# Altium schematic sheet 01_low cost 6308.SchDoc
size A3; SheetNumber: 2; SheetTotal: 16
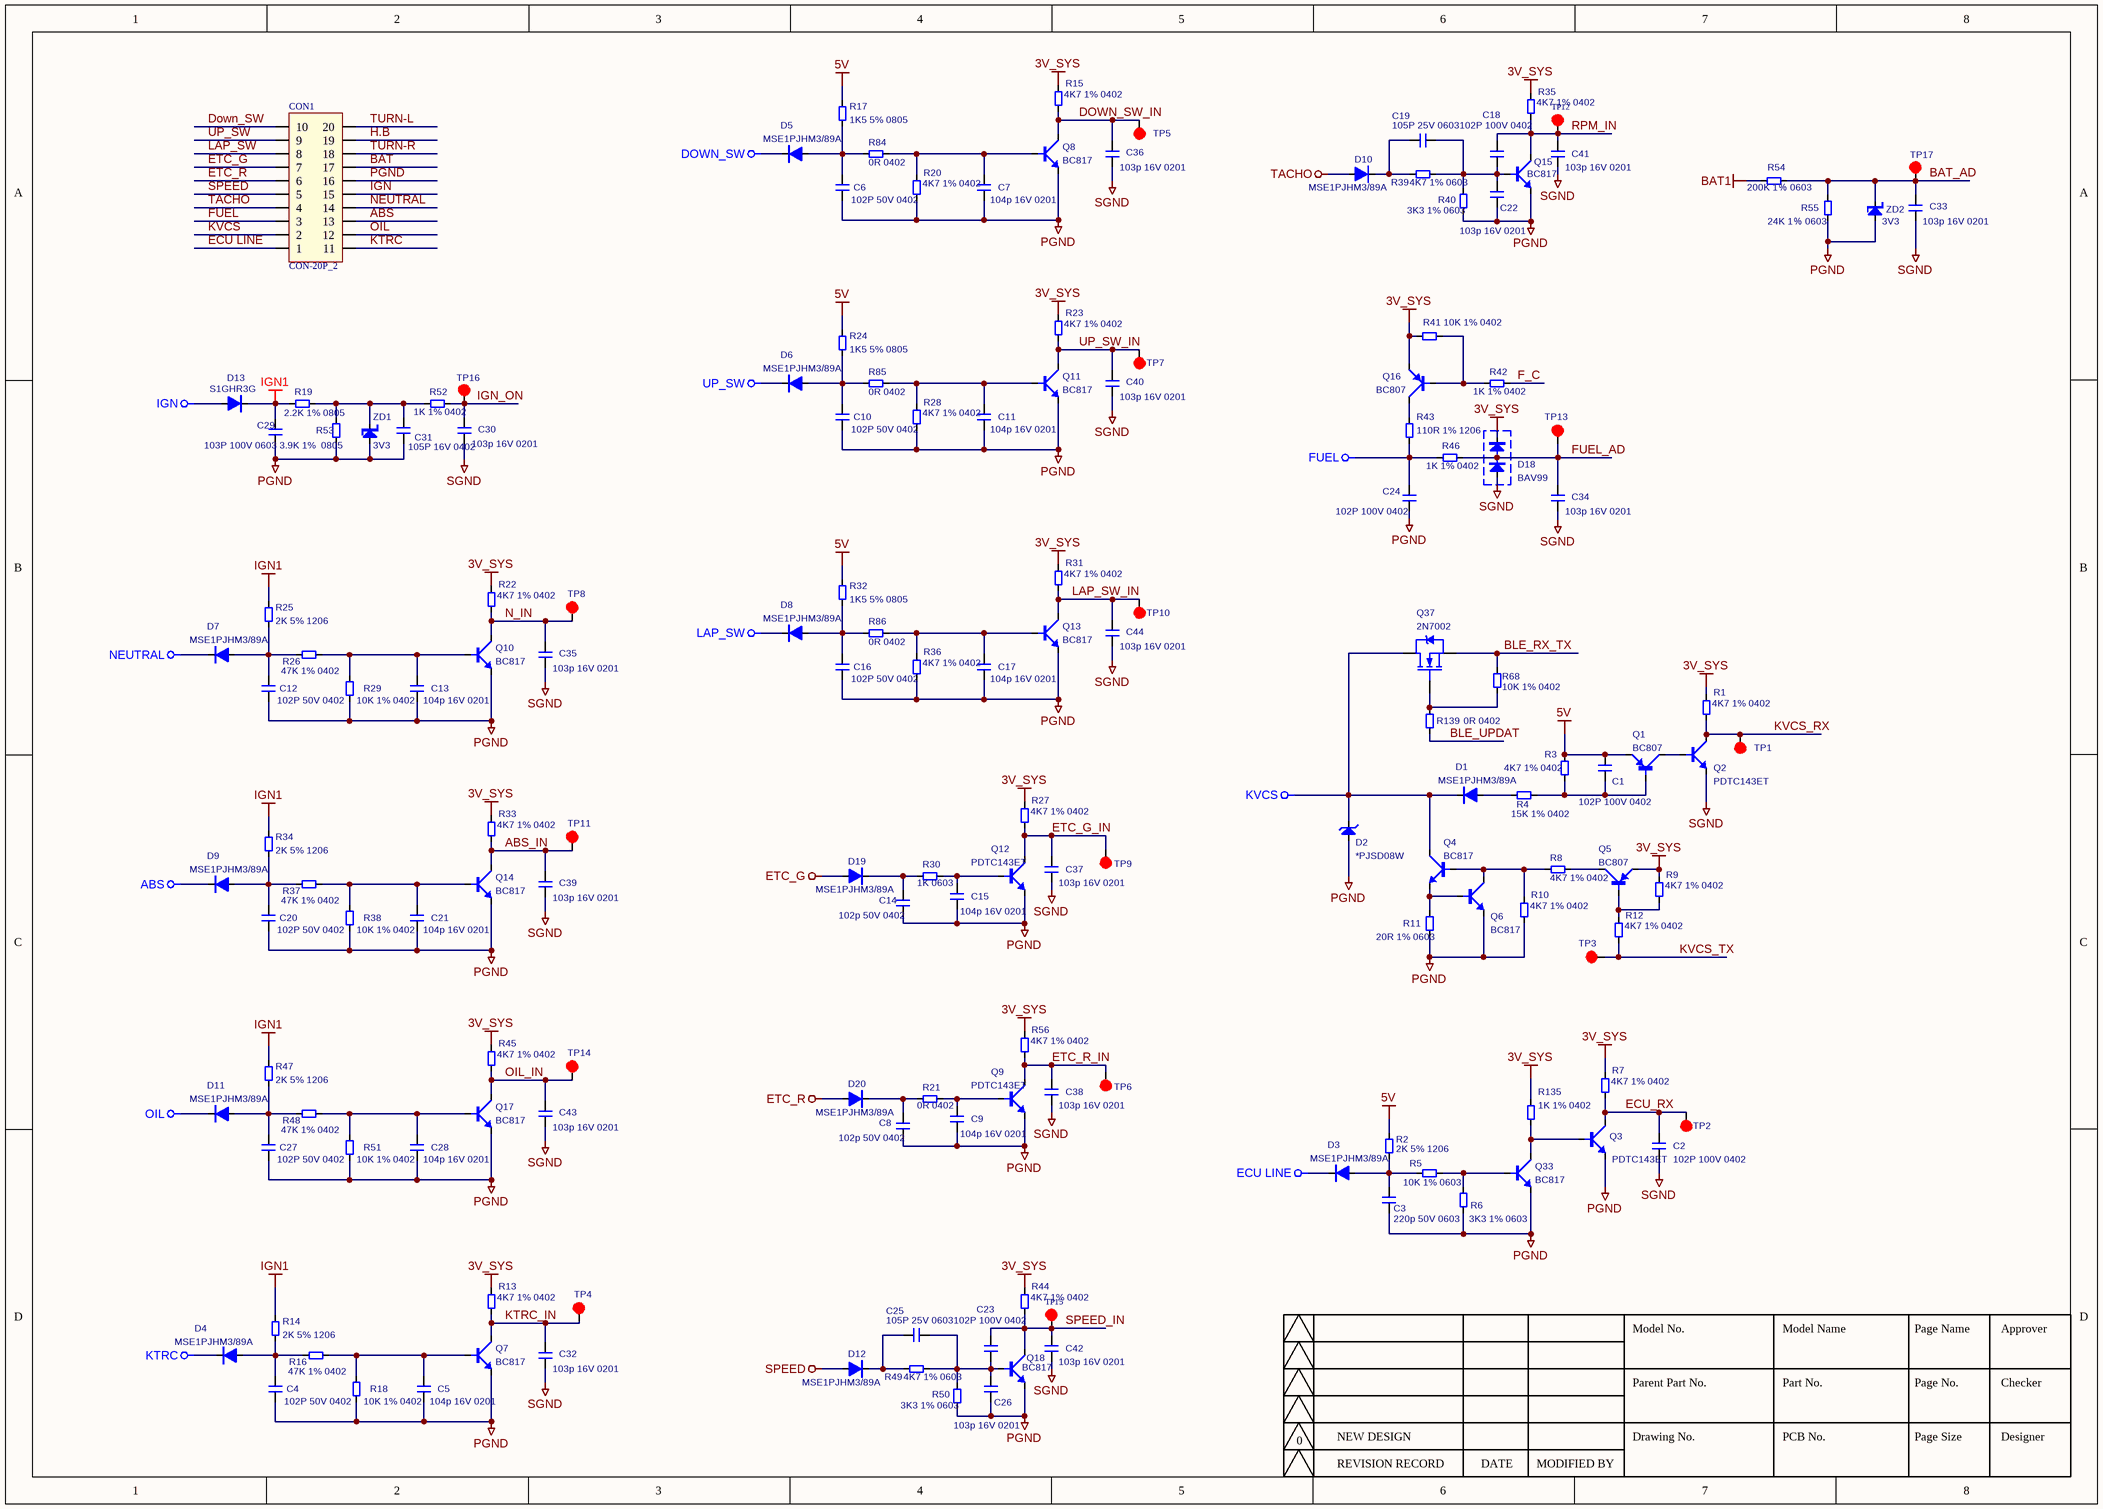
[diagram p0: 01_low cost 6308.SchDoc]

## Parts
C1  102P 100V 0402  [C0402]
C2  102P 100V 0402  [C0402]
C3  220p 50V 0603  [C0603]
C4  102P 50V 0402  [C0402]
C5  104p 16V 0201  [C0201]
C6  102P 50V 0402  [C0402]
C7  104p 16V 0201  [C0201]
C8  102p 50V 0402  [C0402]
C9  104p 16V 0201  [C0201]
C10  102P 50V 0402  [C0402]
C11  104p 16V 0201  [C0201]
C12  102P 50V 0402  [C0402]
C13  104p 16V 0201  [C0201]
C14  102p 50V 0402  [C0402]
C15  104p 16V 0201  [C0201]
C16  102P 50V 0402  [C0402]
C17  104p 16V 0201  [C0201]
C18  102P 100V 0402  [C0402]
C19  105P 25V 0603  [C0603]
C20  102P 50V 0402  [C0402]
C21  104p 16V 0201  [C0201]
C22  103p 16V 0201  [C0201]
C23  102P 100V 0402  [C0402]
C24  102P 100V 0402  [C0402]
C25  105P 25V 0603  [C0603]
C26  103p 16V 0201  [C0201]
C27  102P 50V 0402  [C0402]
C28  104p 16V 0201  [C0201]
C29  103P 100V 0603  [C0603]
C30  103p 16V 0201  [C0201]
C31  105P 16V 0402  [C0402]
C32  103p 16V 0201  [C0201]
C33  103p 16V 0201  [C0201]
C34  103p 16V 0201  [C0201]
C35  103p 16V 0201  [C0201]
C36  103p 16V 0201  [C0201]
C37  103p 16V 0201  [C0201]
C38  103p 16V 0201  [C0201]
C39  103p 16V 0201  [C0201]
C40  103p 16V 0201  [C0201]
C41  103p 16V 0201  [C0201]
C42  103p 16V 0201  [C0201]
C43  103p 16V 0201  [C0201]
C44  103p 16V 0201  [C0201]
CON1  CON-20P_2  [CON-MX34020UF]
D1  MSE1PJHM3/89A  [D-DO-219AD]
D2  *PJSD08W  [ZD-SOD323]
D3  MSE1PJHM3/89A  [D-DO-219AD]
D4  MSE1PJHM3/89A  [D-DO-219AD]
D5  MSE1PJHM3/89A  [D-DO-219AD]
D6  MSE1PJHM3/89A  [D-DO-219AD]
D7  MSE1PJHM3/89A  [D-DO-219AD]
D8  MSE1PJHM3/89A  [D-DO-219AD]
D9  MSE1PJHM3/89A  [D-DO-219AD]
D10  MSE1PJHM3/89A  [D-DO-219AD]
D11  MSE1PJHM3/89A  [D-DO-219AD]
D12  MSE1PJHM3/89A  [D-DO-219AD]
D13  S1GHR3G  [D-SMA]
D18  BAV99  [SOT23-RF]
D19  MSE1PJHM3/89A  [D-DO-219AD]
D20  MSE1PJHM3/89A  [D-DO-219AD]
Q1  BC807  [SOT323]
Q2  PDTC143ET  [SOT23-RF]
Q3  PDTC143ET  [SOT23-RF]
Q4  BC817  [SOT323]
Q5  BC807  [SOT323]
Q6  BC817  [SOT323]
Q7  BC817  [SOT323]
Q8  BC817  [SOT323]
Q9  PDTC143ET  [SOT23-RF]
Q10  BC817  [SOT323]
Q11  BC817  [SOT323]
Q12  PDTC143ET  [SOT23-RF]
Q13  BC817  [SOT323]
Q14  BC817  [SOT323]
Q15  BC817  [SOT323]
Q16  BC807  [SOT23-RF]
Q17  BC817  [SOT323]
Q18  BC817  [SOT323]
Q33  BC817  [SOT323]
Q37  2N7002  [SOT23-RF]
R1  4K7 1% 0402  [0402]
R2  2K 5% 1206  [1206]
R3  4K7 1% 0402  [0402]
R4  15K 1% 0402  [0402]
R5  10K 1% 0603  [0603]
R6  3K3 1% 0603  [0603]
R7  4K7 1% 0402  [0402]
R8  4K7 1% 0402  [0402]
R9  4K7 1% 0402  [0402]
R10  4K7 1% 0402  [0402]
R11  20R 1% 0603  [0603]
R12  4K7 1% 0402  [0402]
R13  4K7 1% 0402  [0402]
R14  2K 5% 1206  [1206]
R15  4K7 1% 0402  [0402]
R16  47K 1% 0402  [0402]
R17  1K5 5% 0805  [0805]
R18  10K 1% 0402  [0402]
R19  2.2K 1% 0805  [0805]
R20  4K7 1% 0402  [0402]
R21  0R 0402  [0402]
R22  4K7 1% 0402  [0402]
R23  4K7 1% 0402  [0402]
R24  1K5 5% 0805  [0805]
R25  2K 5% 1206  [1206]
R26  47K 1% 0402  [0402]
R27  4K7 1% 0402  [0402]
R28  4K7 1% 0402  [0402]
R29  10K 1% 0402  [0402]
R30  1K 0603  [0603]
R31  4K7 1% 0402  [0402]
R32  1K5 5% 0805  [0805]
R33  4K7 1% 0402  [0402]
R34  2K 5% 1206  [1206]
R35  4K7 1% 0402  [0402]
R36  4K7 1% 0402  [0402]
R37  47K 1% 0402  [0402]
R38  10K 1% 0402  [0402]
R39  4K7 1% 0603  [0603]
R40  3K3 1% 0603  [0603]
R41  10K 1% 0402  [0402]
R42  1K 1% 0402  [0402]
R43  110R 1% 1206  [1206]
R44  4K7 1% 0402  [0402]
R45  4K7 1% 0402  [0402]
R46  1K 1% 0402  [0402]
R47  2K 5% 1206  [1206]
R48  47K 1% 0402  [0402]
R49  4K7 1% 0603  [0603]
R50  3K3 1% 0603  [0603]
R51  10K 1% 0402  [0402]
R52  1K 1% 0402  [0402]
R53  3.9K 1%  0805  [0805]
R54  200K 1％ 0603  [0603]
R55  24K 1％ 0603  [0603]
R56  4K7 1% 0402  [0402]
R68  10K 1% 0402  [0402]
R84  0R 0402  [0402]
R85  0R 0402  [0402]
R86  0R 0402  [0402]
R135  1K 1% 0402  [0402]
R139  0R 0402  [0402]
TP1  TEST  [TEST]  (value not drawn)  (no BOM)
TP2  TEST  [TEST]  (value not drawn)  (no BOM)
TP3  TEST  [TEST]  (value not drawn)  (no BOM)
TP4  TEST  [TEST]  (value not drawn)  (no BOM)
TP5  TEST  [TEST]  (value not drawn)  (no BOM)
TP6  TEST  [TEST]  (value not drawn)
TP7  TEST  [TEST]  (value not drawn)  (no BOM)
TP8  TEST  [TEST]  (value not drawn)  (no BOM)
TP9  TEST  [TEST]  (value not drawn)
TP10  TEST  [TEST]  (value not drawn)  (no BOM)
TP11  TEST  [TEST]  (value not drawn)  (no BOM)
TP12  TEST  [TEST]  (value not drawn)
TP13  TEST  [TEST]  (value not drawn)  (no BOM)
TP14  TEST  [TEST]  (value not drawn)  (no BOM)
TP15  TEST  [TEST]  (value not drawn)
TP16  TEST  [TEST]  (value not drawn)
TP17  TEST  [TEST]  (value not drawn)  (no BOM)
ZD1  3V3  [SOT23-RF]
ZD2  3V3  [SOT23-RF]

## Nets
3V_SYS: D18.3(K) Q5.3(E) Q16.3(E) R1.1 R7.1 R9.1 R13.1 R15.1 R22.1 R23.1 R27.1 R31.1 R33.1 R35.1 R41.1 R44.1 R45.1 R56.1 R135.2
5V: C1.1 Q1.3(E) R2.1 R3.1 R17.1 R24.1 R32.1
ABS: CON1.13 D9.2(K)
BAT1: R54.1
Down_SW: CON1.10 D5.2(K)
ECU LINE: CON1.1 D3.2(K)
ETC_G: CON1.7 D19.1(A)
ETC_R: CON1.6 D20.1(A)
FUEL: C24.1 CON1.3 R43.2 R46.2
IGN: CON1.15 D13.1(A)
IGN1: C29.1 D13.2(K) R14.1 R19.1 R25.1 R34.1 R47.1
KTRC: CON1.11 D4.2(K)
KVCS: CON1.2 D1.2(K) D2.2 Q4.2(C) Q37.2(D)
LAP_SW: CON1.8 D8.2(K)
NEUTRAL: CON1.14 D7.2(K)
OIL: CON1.12 D11.2(K)
PGND: C3.1 C4.1 C5.2 C6.1 C7.2 C8.1 C9.2 C10.1 C11.2 C12.1 C13.2 C14.1 C15.2 C16.1 C17.2 C20.1 C21.2 C22.2 C24.2 C26.2 C27.1 C28.2 C29.2 C31.2 CON1.16 D2.1 Q3.3(E) Q6.3(E) Q7.3(E) Q8.3(E) Q9.3(E) Q10.3(E) Q11.3(E) Q12.3(E) Q13.3(E) Q14.3(E) Q15.3(E) Q17.3(E) Q18.3(E) Q33.3(E) R6.1 R10.2 R11.1 R18.2 R20.2 R28.2 R29.2 R36.2 R38.2 R40.1 R50.1 R51.2 R53.2 R55.2 ZD1.1(A) ZD2.1(A)
SGND: C2.2 C30.2 C32.2 C33.2 C34.2 C35.2 C36.2 C37.2 C38.2 C39.2 C40.2 C41.2 C42.2 C43.2 C44.2 D18.1(A) Q2.3(E)
SPEED: CON1.5 D12.1(A)
TACHO: CON1.4 D10.1(A)
UP_SW: CON1.9 D6.2(K)
ABS_IN: C39.1 Q14.2(C) R33.2 TP11.TP
BAT: CON1.17
BAT_AD: C33.1 R54.2 R55.1 TP17.TP ZD2.2(K)
BLE_RX_TX: Q37.3(S) R68.2
BLE_UPDAT: R139.1
DOWN_SW_IN: C36.1 Q8.2(C) R15.2 TP5.TP
ECU_RX: C2.1 Q3.2(C) R7.2 TP2.TP
ETC_G_IN: C37.1 Q12.2(C) R27.2 TP9.TP
ETC_R_IN: C38.1 Q9.2(C) R56.2 TP6.TP
F_C: R42.1
FUEL_AD: C34.1 D18.2(KA) R46.1 TP13.TP
H.B: CON1.19
IGN_ON: C30.1 R52.1 TP16.TP
KTRC_IN: C32.1 Q7.2(C) R13.2 TP4.TP
KVCS_RX: Q2.2(C) R1.2 TP1.TP
KVCS_TX: R12.2 TP3.TP
LAP_SW_IN: C44.1 Q13.2(C) R31.2 TP10.TP
N_IN: C35.1 Q10.2(C) R22.2 TP8.TP
OIL_IN: C43.1 Q17.2(C) R45.2 TP14.TP
RPM_IN: C18.1 C41.1 Q15.2(C) R35.2 TP12.TP
SPEED_IN: C23.1 C42.1 Q18.2(C) R44.2 TP15.TP
TURN-L: CON1.20
TURN-R: CON1.18
UP_SW_IN: C40.1 Q11.2(C) R23.2 TP7.TP
NetC1_2: C1.2 Q1.1(B) R3.2 R4.2
NetC3_2: C3.2 D3.1(A) R2.2 R5.2
NetC4_2: C4.2 D4.1(A) R14.2 R16.2
NetC5_1: C5.1 Q7.1(B) R16.1 R18.1
NetC6_2: C6.2 D5.1(A) R17.2 R84.1
NetC7_1: C7.1 Q8.1(B) R20.1 R84.2
NetC8_2: C8.2 D20.2(K) R21.2
NetC9_1: C9.1 Q9.1(B) R21.1
NetC10_2: C10.2 D6.1(A) R24.2 R85.1
NetC11_1: C11.1 Q11.1(B) R28.1 R85.2
NetC12_2: C12.2 D7.1(A) R25.2 R26.2
NetC13_1: C13.1 Q10.1(B) R26.1 R29.1
NetC14_2: C14.2 D19.2(K) R30.2
NetC15_1: C15.1 Q12.1(B) R30.1
NetC16_2: C16.2 D8.1(A) R32.2 R86.1
NetC17_1: C17.1 Q13.1(B) R36.1 R86.2
NetC18_2: C18.2 C19.1 C22.1 Q15.1(B) R39.1 R40.2
NetC19_2: C19.2 D10.2(K) R39.2
NetC20_2: C20.2 D9.1(A) R34.2 R37.2
NetC21_1: C21.1 Q14.1(B) R37.1 R38.1
NetC23_2: C23.2 C25.1 C26.1 Q18.1(B) R49.1 R50.2
NetC25_2: C25.2 D12.2(K) R49.2
NetC27_2: C27.2 D11.1(A) R47.2 R48.2
NetC28_1: C28.1 Q17.1(B) R48.1 R51.1
NetC31_1: C31.1 R19.2 R52.2 R53.1 ZD1.2(K)
NetD1_1: D1.1(A) R4.1
NetQ1_2: Q1.2(C) Q2.1(B)
NetQ3_1: Q3.1(B) Q33.2(C) R135.1
NetQ4_1: Q4.1(B) Q6.2(C) R8.1 R10.1
NetQ4_3: Q4.3(E) Q6.1(B) R11.2
NetQ5_1: Q5.1(B) R9.2 R12.1
NetQ5_2: Q5.2(C) R8.2
NetQ16_1: Q16.1(B) R41.2 R42.2
NetQ16_2: Q16.2(C) R43.1
NetQ33_1: Q33.1(B) R5.1 R6.2
NetQ37_1: Q37.1(G) R68.1 R139.2

## Notes on the sheet
- Model No.
- Parent Part No.
- Part No.
- Model Name
- Page Name
- Page No.
- Approver
- Checker
- 0
- NEW DESIGN
- Drawing No.
- PCB No.
- Page Size
- Designer
- REVISION RECORD
- DATE
- MODIFIED BY

## Library data of the parts
C1 C2 C18 C23 C24 = C: Capacitor; z02-包裝or系列名稱: 0603，0805，1206，DIP; z01-耐壓or瓦特數: 16V，25V，50V，100V; z03-誤差: B，C，D，F，G，J，K，M，Z; z05-廠牌: MURATA，TDK; z04-參數: NPO，COG，X7R，Y5V; A-TOP: V31-01102201; 01-範例: 容值 耐壓 包裝 誤差 參數; z99-略1~101P: 50V 0603 J NP0(C0G) 廠牌; z99-略102P~104P↑: 50V 0603 K X7R  廠牌; z00-值or編碼: *P
C3 = C: Capacitor; z02-包裝or系列名稱: 0603，0805，1206，DIP; z01-耐壓or瓦特數: 16V，25V，50V，100V; z03-誤差: B，C，D，F，G，J，K，M，Z; z05-廠牌: MURATA，TDK; z04-參數: NPO，COG，X7R，Y5V; A-TOP: V31-22132; 01-範例: 容值 耐壓 包裝 誤差 參數; z99-略1~101P: 50V 0603 J NP0(C0G) 廠牌; z99-略102P~104P↑: 50V 0603 K X7R  廠牌; z00-值or編碼: *P
C4 C6 C8 C10 C12 C14 C16 C20 C27 = C: Capacitor; z02-包裝or系列名稱: 0603，0805，1206，DIP; z01-耐壓or瓦特數: 16V，25V，50V，100V; z03-誤差: B，C，D，F，G，J，K，M，Z; z05-廠牌: MURATA，TDK; z04-參數: NPO，COG，X7R，Y5V; A-TOP: V31-A1102200; 01-範例: 容值 耐壓 包裝 誤差 參數; z99-略1~101P: 50V 0603 J NP0(C0G) 廠牌; z99-略102P~104P↑: 50V 0603 K X7R  廠牌; z00-值or編碼: *P
C5 C7 C9 C11 C13 C15 C17 C21 C28 = C: Capacitor; z02-包裝or系列名稱: 0603，0805，1206，DIP; z01-耐壓or瓦特數: 16V，25V，50V，100V; z03-誤差: B，C，D，F，G，J，K，M，Z; z05-廠牌: MURATA，TDK; z04-參數: NPO，COG，X7R，Y5V; A-TOP: V31-A1104100; 01-範例: 容值 耐壓 包裝 誤差 參數; z99-略1~101P: 50V 0603 J NP0(C0G) 廠牌; z99-略102P~104P↑: 50V 0603 K X7R  廠牌; z00-值or編碼: *P
C19 C25 = C: Capacitor; z02-包裝or系列名稱: 0603，0805，1206，DIP; z01-耐壓or瓦特數: 16V，25V，50V，100V; z03-誤差: B，C，D，F，G，J，K，M，Z; z05-廠牌: MURATA，TDK; z04-參數: NPO，COG，X7R，Y5V; A-TOP: V31-10522; 01-範例: 容值 耐壓 包裝 誤差 參數; z99-略1~101P: 50V 0603 J NP0(C0G) 廠牌; z99-略102P~104P↑: 50V 0603 K X7R  廠牌; z00-值or編碼: *P
C22 C26 C30 C32-C44 = C: Capacitor; z02-包裝or系列名稱: 0603，0805，1206，DIP; z01-耐壓or瓦特數: 16V，25V，50V，100V; z03-誤差: B，C，D，F，G，J，K，M，Z; z05-廠牌: MURATA，TDK; z04-參數: NPO，COG，X7R，Y5V; A-TOP: V31-A1103100; 01-範例: 容值 耐壓 包裝 誤差 參數; z99-略1~101P: 50V 0603 J NP0(C0G) 廠牌; z99-略102P~104P↑: 50V 0603 K X7R  廠牌; z00-值or編碼: *P
C29 = C: Capacitor; z02-包裝or系列名稱: 0603，0805，1206，DIP; z01-耐壓or瓦特數: 16V，25V，50V，100V; z03-誤差: B，C，D，F，G，J，K，M，Z; z05-廠牌: MURATA，TDK; z04-參數: NPO，COG，X7R，Y5V; A-TOP: V31-01103300; 01-範例: 容值 耐壓 包裝 誤差 參數; z99-略1~101P: 50V 0603 J NP0(C0G) 廠牌; z99-略102P~104P↑: 50V 0603 K X7R  廠牌; z00-值or編碼: *P
C31 = C: Capacitor; z02-包裝or系列名稱: 0603，0805，1206，DIP; z01-耐壓or瓦特數: 16V，25V，50V，100V; z03-誤差: B，C，D，F，G，J，K，M，Z; z05-廠牌: MURATA，TDK; z04-參數: NPO，COG，X7R，Y5V; A-TOP: V31-01105200; 01-範例: 容值 耐壓 包裝 誤差 參數; z99-略1~101P: 50V 0603 J NP0(C0G) 廠牌; z99-略102P~104P↑: 50V 0603 K X7R  廠牌; z00-值or編碼: *P
CON1 = CON-20P_2: z10-LCD: 若為LCD，則A-TOP填入該料號。; A-TOP: 20P MX34; 01-範例: PIN數 系列 角度; z00-值or編碼: PIN數; z02-包裝or系列名稱: MX34，04040，04049; z08-腳長or角度: 90°=V，180°=略，上接=RU，下接-RL; z09-客戶專用: LOCAL件=L，日本原廠件不標
D1 D3-D12 D19 D20 = D-SMD: SK54-AU/BAS16/RR264/1N4148/FM4004/SS14/SSL14/V15PL50/DO-219AD; z2-包裝: 2F，SOT23，SMA，SMB，SMC，LL34，SOD323，PMDU，SOD123，SOD123FL，SMPC; z0-編號: BAS16，BAV99，RR264，1N4148W，FM4004，V15PL50; 01-範例: 編碼 包裝(SOT23略); A-TOP值參考: VS-1EQH02HM3，SK54-AU，MSE1PJHM3/89A; A-TOP: MSE1PJHM3/89A
D2 = TVS-SMD: A-TOP: PJSD08W SOD323
D13 = D-SMD: BAS16/RR264/1N4148/FM4004/SS14/SSL14/V15PL50; z2-包裝: SOT23，SMA，SMB，SMC，LL34，SOD323，PMDU，SOD123，SOD123FL，SMPC; z0-編號: BAS16，BAV99，RR264，1N4148，FM4004，SS14，SSL14，V15PL50; A-TOP: S1GHR; 01-範例: 編碼 包裝(SOT23略)
D18 = D-AKAK_1: z02-包裝or系列名稱: SOT23略; 01-範例: 編碼 包裝; z00-值or編碼: BAV99; A-TOP: BAV99
Q1 Q5 = Q-PNP(BCE): BC807，2SA1812，PBSS9110T; 包裝: SOT23，SOT89; A-TOP: new; 01-範例: 編碼 包裝(SOT23略); 編號: BC807，2SA1812，PBSS9110T
Q2 = Q-NPN(BCE): BC817/PDTC143ET/2SD2211/2SD1918; z0-編號: BC817，PDTC143ET，2SD2211，2SD1918; z1-包裝: SOT23，SOT89，DPAK; 01-範例: 編號 包裝(SOT23略略; A-TOP: PDTC143ET
Q3 Q9 Q12 = Q-NPN(BCE): BC817，PDTC143ET，2SD2211，2SD1918; 01-範例: 編號 包裝(SOT23略); z1-包裝: SOT23，SOT89，DPAK; A-TOP: PDTC143ET; z0-編號: BC817，PDTC143ET，2SD2211，2SD1918
Q4 Q7 Q8 Q10 Q11 Q13 Q14 Q17 Q33 = Q-NPN(BCE): BC817，PDTC143ET，2SD2211，2SD1918; z1-包裝: SOT23，SOT89，DPAK; A-TOP: NEW; 01-範例: 編號 包裝(SOT23略); z0-編號: BC817，PDTC143ET，2SD2211，2SD1918
Q6 Q15 Q18 = Q-NPN(BCE): BC817，PDTC143ET，2SD2211，2SD1918; 01-範例: 編號 包裝(SOT23略); A-TOP: NEW; z1-包裝: SOT23，SOT89，DPAK; z0-編號: BC817，PDTC143ET，2SD2211，2SD1918
Q16 = Q-PNP(BCE): BC807，2SA1812，PBSS9110T; 包裝: SOT23，SOT89; 01-範例: 編碼 包裝(SOT23略); 編號: BC807，2SA1812，PBSS9110T; A-TOP: BC807
Q37 = MOS N-2: 01-範例: 編碼 包裝; A-TOP: 2N7002
R1 R7-R10 R12 R13 R15 R20 R22 R23 R27 R28 R31 R33 R35 R36 R44 R45 R56 = R: z02-包裝or系列名稱: 0603，1206，2010，2512，MECF200SS; z01-耐壓or瓦特數: Ｘ; z03-誤差: 1％; z05-廠牌: YAGEO，SYNTON，E-COM，WALSIN，EVER; 01-範例: 阻值 包裝(瓦特) 誤差; A-TOP: V02-02047220; z99-省略的部份: 0805 5% 廠牌; z04-參數: Ｘ
R2 R14 R25 R34 R47 = R: z02-包裝or系列名稱: 0603，1206，2010，2512，MECF200SS; z01-耐壓or瓦特數: Ｘ; z03-誤差: 1％; z05-廠牌: YAGEO，SYNTON，E-COM，WALSIN，EVER; 01-範例: 阻值 包裝(瓦特) 誤差; A-TOP: V02-20432; z99-省略的部份: 0805 5% 廠牌; z04-參數: Ｘ
R3 = R: z03-誤差: 1％; z05-廠牌: YAGEO，SYNTON，E-COM，WALSIN，EVER; 01-範例: 阻值 包裝(瓦特) 誤差; A-TOP: V02-02047220; z99-省略的部份: 0805 5% 廠牌; z02-包裝or系列名稱: 0603，1206，2010，2512，MECF200SS; z01-耐壓or瓦特數: Ｘ; z04-參數: Ｘ
R4 = R: z02-包裝or系列名稱: 0603，1206，2010，2512，MECF200SS; z01-耐壓or瓦特數: Ｘ; z03-誤差: 1％; z05-廠牌: YAGEO，SYNTON，E-COM，WALSIN，EVER; 01-範例: 阻值 包裝(瓦特) 誤差; A-TOP: V02-A2115120; z99-省略的部份: 0805 5% 廠牌; z04-參數: Ｘ
R5 = R: z02-包裝or系列名稱: 0603，1206，2010，2512，MECF200SS; z01-耐壓or瓦特數: Ｘ; z03-誤差: 1％; z05-廠牌: YAGEO，SYNTON，E-COM，WALSIN，EVER; 01-範例: 阻值 包裝(瓦特) 誤差; A-TOP: V02-02010331; z99-省略的部份: 0805 5% 廠牌; z04-參數: Ｘ
R6 R40 R50 = R: z03-誤差: 1％; z05-廠牌: YAGEO，SYNTON，E-COM，WALSIN，EVER; 01-範例: 阻值 包裝(瓦特) 誤差; A-TOP: 3K3 0603 1％; z99-省略的部份: 0805 5% 廠牌; z02-包裝or系列名稱: 0603，1206，2010，2512，MECF200SS; z01-耐壓or瓦特數: Ｘ; z04-參數: Ｘ
R11 = R: z02-包裝or系列名稱: 0603，1206，2010，2512，MECF200SS; z01-耐壓or瓦特數: Ｘ; z03-誤差: 1％; z05-廠牌: YAGEO，SYNTON，E-COM，WALSIN，EVER; 01-範例: 阻值 包裝(瓦特) 誤差; A-TOP: V02-2002A; z99-省略的部份: 0805 5% 廠牌; z04-參數: Ｘ
R16 R26 R37 R48 = R: z02-包裝or系列名稱: 0603，1206，2010，2512，MECF200SS; z01-耐壓or瓦特數: Ｘ; z03-誤差: 1％; z05-廠牌: YAGEO，SYNTON，E-COM，WALSIN，EVER; 01-範例: 阻值 包裝(瓦特) 誤差; A-TOP: V02-02047320; z99-省略的部份: 0603 1% 廠牌; z04-參數: Ｘ
R17 R24 R32 = R: z02-包裝or系列名稱: 0603，1206，2010，2512，MECF200SS; z01-耐壓or瓦特數: Ｘ; z03-誤差: 1％; z05-廠牌: YAGEO，SYNTON，E-COM，WALSIN，EVER; 01-範例: 阻值 包裝(瓦特) 誤差; A-TOP: 1K5 0805; z99-省略的部份: 0805 5% 廠牌; z04-參數: Ｘ
R18 R29 R38 R51 = R: z02-包裝or系列名稱: 0603，1206，2010，2512，MECF200SS; z01-耐壓or瓦特數: Ｘ; z03-誤差: 1％; z05-廠牌: YAGEO，SYNTON，E-COM，WALSIN，EVER; 01-範例: 阻值 包裝(瓦特) 誤差; A-TOP: V02-02010320; z99-省略的部份: 0603 1% 廠牌; z04-參數: Ｘ
R19 = R: z03-誤差: 1％; z05-廠牌: YAGEO，SYNTON，E-COM，WALSIN，EVER; 01-範例: 阻值 包裝(瓦特) 誤差; A-TOP: V02-22211; z99-省略的部份: 0805 5% 廠牌; z02-包裝or系列名稱: 0603，1206，2010，2512，MECF200SS; z01-耐壓or瓦特數: Ｘ; z04-參數: Ｘ
R21 R139 = R: z03-誤差: 1％; z05-廠牌: YAGEO，SYNTON，E-COM，WALSIN，EVER; 01-範例: V02-01010320; A-TOP: V02-01000020; z99-省略的部份: 0805 5% 廠牌; z02-包裝or系列名稱: 0603，1206，2010，2512，MECF200SS; z01-耐壓or瓦特數: Ｘ; z04-參數: Ｘ
R30 = R: z03-誤差: 1％; z05-廠牌: YAGEO，SYNTON，E-COM，WALSIN，EVER; 01-範例: V02-01010320; A-TOP: 1K 1% 0603 國; z99-省略的部份: 0805 5% 廠牌; z02-包裝or系列名稱: 0603，1206，2010，2512，MECF200SS; z01-耐壓or瓦特數: Ｘ; z04-參數: Ｘ
R39 R49 = R: z03-誤差: 1％; z05-廠牌: YAGEO，SYNTON，E-COM，WALSIN，EVER; 01-範例: 阻值 包裝(瓦特) 誤差; A-TOP: 4K7 0603 1％; z99-省略的部份: 0805 5% 廠牌; z02-包裝or系列名稱: 0603，1206，2010，2512，MECF200SS; z01-耐壓or瓦特數: Ｘ; z04-參數: Ｘ
R41 R68 = R: z03-誤差: 1％; z05-廠牌: YAGEO，SYNTON，E-COM，WALSIN，EVER; 01-範例: 10K 0603 1％; A-TOP: V02-02010320; z99-省略的部份: 0805 5% 廠牌; z02-包裝or系列名稱: 0603，1206，2010，2512，MECF200SS; z01-耐壓or瓦特數: Ｘ; z04-參數: Ｘ
R42 R46 R52 R135 = R: z03-誤差: 1％; z05-廠牌: YAGEO，SYNTON，E-COM，WALSIN，EVER; 01-範例: 阻值 包裝(瓦特) 誤差; A-TOP: V02-A2001320; z99-省略的部份: 0805 5% 廠牌; z02-包裝or系列名稱: 0603，1206，2010，2512，MECF200SS; z01-耐壓or瓦特數: Ｘ; z04-參數: Ｘ
R43 = R: z03-誤差: 1％; z05-廠牌: YAGEO，SYNTON，E-COM，WALSIN，EVER; 01-範例: 阻值 包裝(瓦特) 誤差; A-TOP: 110R 1206 1％; z99-省略的部份: 0805 5% 廠牌; z02-包裝or系列名稱: 0603，1206，2010，2512，MECF200SS; z01-耐壓or瓦特數: Ｘ; z04-參數: Ｘ
R53 = R: z03-誤差: 1％; z05-廠牌: YAGEO，SYNTON，E-COM，WALSIN，EVER; 01-範例: 阻值 包裝(瓦特) 誤差; A-TOP: V02-39211; z99-省略的部份: 0805 5% 廠牌; z02-包裝or系列名稱: 0603，1206，2010，2512，MECF200SS; z01-耐壓or瓦特數: Ｘ; z04-參數: Ｘ
R54 = R: z02-包裝or系列名稱: 0603，1206，2010，2512，MECF200SS; z01-耐壓or瓦特數: Ｘ; z05-廠牌: YAGEO，SYNTON，E-COM，WALSIN，EVER; 01-範例: 阻值 包裝(瓦特) 誤差; A-TOP: V02-20421; z99-省略的部份: 0805 5% 廠牌; z03-誤差: 1％; z04-參數: Ｘ
R55 = R: z02-包裝or系列名稱: 0603，1206，2010，2512，MECF200SS; z01-耐壓or瓦特數: Ｘ; z05-廠牌: YAGEO，SYNTON，E-COM，WALSIN，EVER; 01-範例: 阻值 包裝(瓦特) 誤差; A-TOP: V02-24321; z99-省略的部份: 0805 5% 廠牌; z03-誤差: 1％; z04-參數: Ｘ
R84-R86 = R: z02-包裝or系列名稱: 0603，1206，2010，2512，MECF200SS; z01-耐壓or瓦特數: Ｘ; z03-誤差: 1％; z05-廠牌: YAGEO，SYNTON，E-COM，WALSIN，EVER; 01-範例: 阻值 包裝(瓦特) 誤差; A-TOP: V02-01000020; z99-省略的部份: 0805 5% 廠牌; z04-參數: Ｘ
ZD1 ZD2 = ZENER: A-TOP: V13-13312; 01-範例: 耐壓 包裝 瓦特數 誤差; z01-耐壓or瓦特數: 1／2W，1W，1．5W; z02-包裝or系列名稱: SMA，SMB，SMC，LL34，SOT23略; z03-誤差: 1％，2％，5％略; z00-值or編碼: ZD：值